# EAGLE design scheme3 (EAGLE 8.1.0)
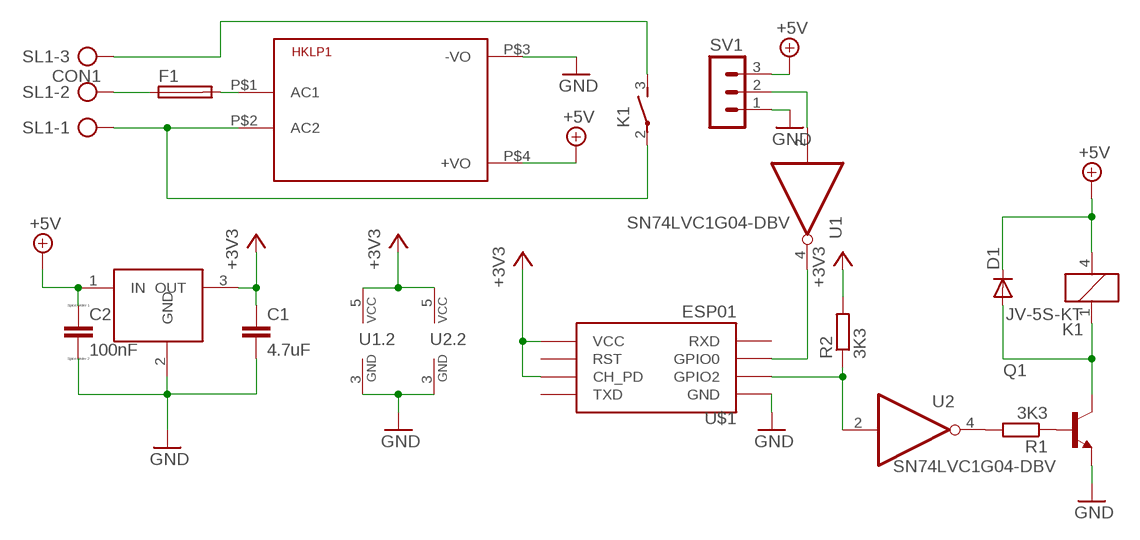
[diagram p0: schematic, sheet 1]

## Parts
C1  4.7uF  C-EUC0805  [C0805]
C2  100nF  CC0603  [C0603]
D1  D-SOD123  [SOD123]
F1  TE5  [TE5]
HKLP1  HKLPM01  [HKLPM01]
K1  JV-5S-KT  [JV-KT]
Q1  BC817-16-NPN-SOT23-BEC  [SOT23-BEC]
R1  3K3  R-EU_R0603  [R0603]
R2  3K3  R-EU_R0603  [R0603]
SL1  CON1  AK300/3  [AK300/3]
SV1  MA03-1  [MA03-1]
U1  SN74LVC1G04-DBV  [SOT23-5]
U2  SN74LVC1G04-DBV  [SOT23-5]
U$1  ESP01  [ESP01]
U$2  LF33CV  [TO220V]

## Nets
+3V3: C1.1 R2.2 U1.5(VCC) U2.5(VCC) U$1.CH_PD U$1.VCC U$2.3(OUT)
+5V: C2.1 D1.1(C) HKLP1.P$4(+VO) K1.4 SV1.3 U$2.1(IN)
GND: C1.2 C2.2 HKLP1.P$3(-VO) Q1.E SV1.1 U1.3(GND) U2.3(GND) U$1.GND U$2.2(GND)
N$1: Q1.B R1.1
N$2: R2.1 U2.2(A) U$1.GPIO2
N$4: R1.2 U2.4(Y)
N$5: D1.2(A) K1.1 Q1.C
N$6: F1.1 SL1.2
N$7: SV1.2 U1.2(A)
N$8: HKLP1.P$2(AC2) K1.2(P) SL1.1
N$9: K1.3(S) SL1.3
N$10: F1.2 HKLP1.P$1(AC1)
N$11: U1.4(Y) U$1.GPIO0
Unconnected: U$1.RST U$1.RX(RXD) U$1.TX(TXD)

## Library data of the parts
C1 = resistor:C-EU: CAPACITOR, European symbol
C2 = eagle-ltspice:C: CAPACITOR, European symbol; SPICEMODEL: NONE; SPICEPREFIX: C
D1 = semicon-smd-ipc:D-: DIODE unfilled
F1 = fuse:TE5: FUSE Wickmann; OC_FARNELL: unknown; OC_NEWARK: unknown
HKLP1 = HKLPM01:HKLPM01
K1 = relay:JV*-KT: POWER RELAY JV SERIES 1 POLE—5 A (MEDIUM LOAD CONTROL) Source: Data sheet <http://www.produktinfo.conrad.com/datenblaetter/500000-524999/502946-da-01-en-RELAIS_JV_12S_KT.pdf>
Q1 = transistor:*-NPN-: NPN Transistror BF959 corrected 2008.03.06
R1 R2 = resistor:R-EU_: RESISTOR, European symbol
SL1 = con-ptr500:AK300/3: CONNECTOR; OC_FARNELL: unknown; OC_NEWARK: unknown
SV1 = con-lstb:MA03-1: PIN HEADER; OC_FARNELL: unknown; OC_NEWARK: unknown
U1 U2 = m-pad-2.1:SN74LVC1G04: Ti's SN74LVC1G04 SINGLE INVERTER GATE Description: This single inverter gate is designed for 1.65-V to 5.5-V VCC operation. The SN74LVC1G04 performs the Boolean function Y = /A. NanoStar and NanoFree package technology is a major breakthrough in IC packaging concepts, using the die as the package. This device is fully specified for partial-power-down applications using Ioff. The Ioff circuitry disables the outputs, preventing damaging current backflow through the device when it is powered down. Features: Available in the Texas Instruments NanoStar? and NanoFree? Packages Ioff Supports Partial-Power-Down Mode Operation Supports 5-V VCC Operation · Latch-Up Performance Exceeds 100 mA Per Inputs Accept Voltages to 5.5 V JESD 78, Class II Max tpd of 3.3 ns at 3.3 V Low Power Consumption, 10-uA Max ICC ±24-mA Output Drive at 3.3 V ESD Protection Exceeds JESD 22 - 2000-V Human-Body Model (A114-A) - 200-V Machine Model (A115-A) - 1000-V Charged-Device Model (C101) Please send any comments to: messi@users.sourceforge.net
U$1 = esp8266modules:ESP01: ESP8266 Wifi module 01
U$2 = LF33CV:LF33CV

## Board
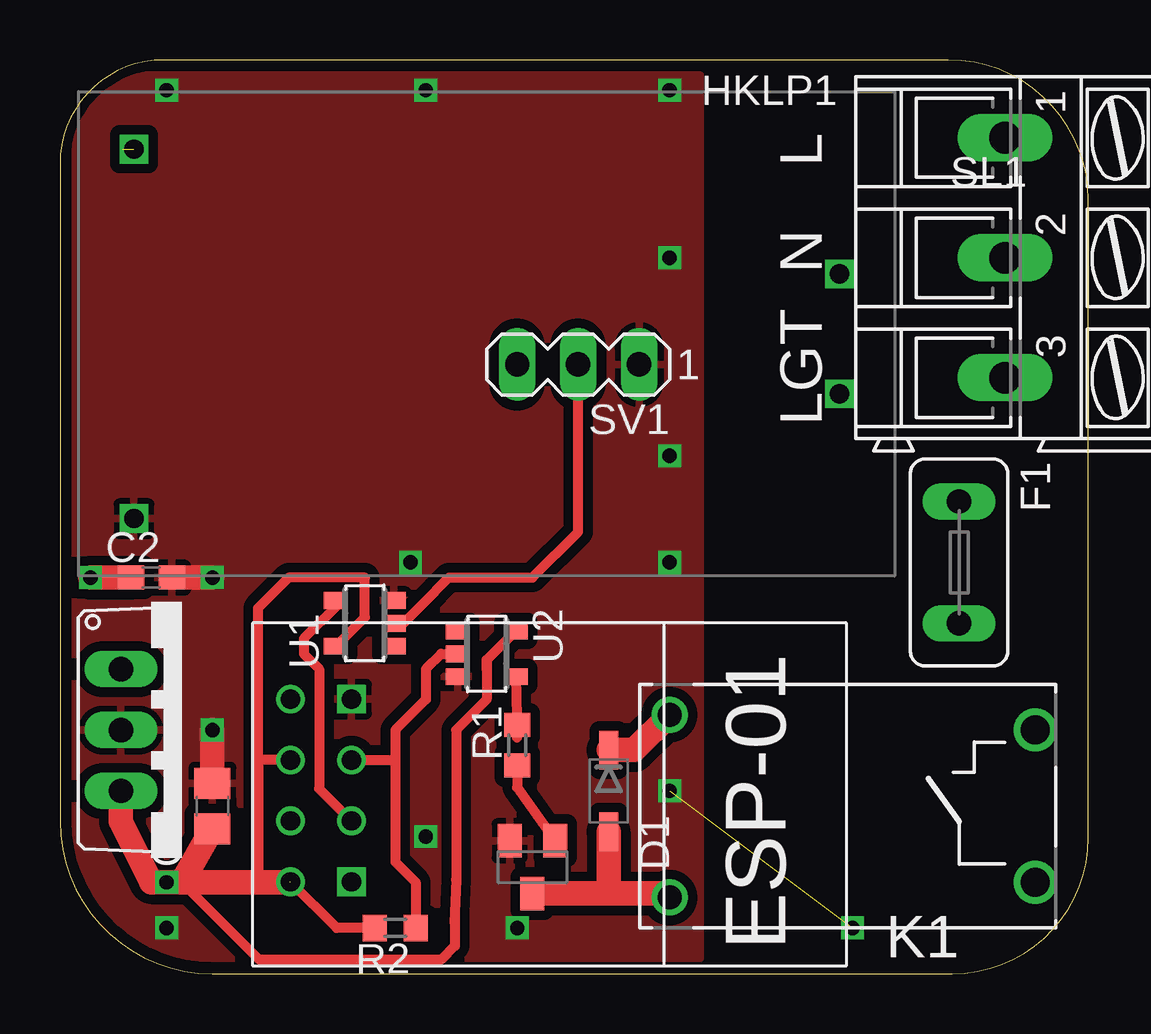
[diagram p1: board, top side]
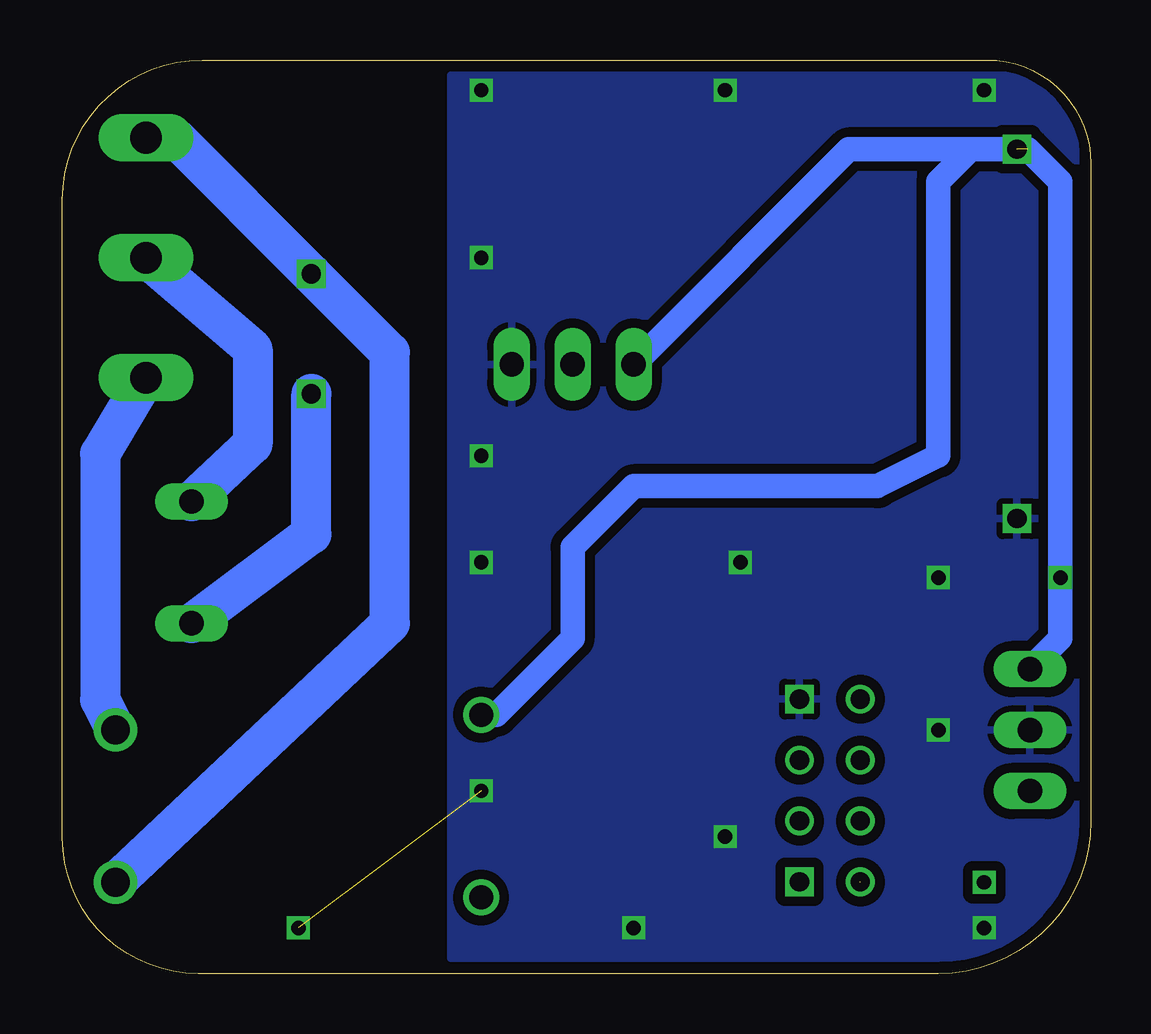
[diagram p2: board, bottom side, seen from below]

Size 42.85 x 38.09 mm. Coordinates in mm from the lower left corner, seen from the top.
Outline: 42.85,5.66 42.85,32.26 arc90 37.02,38.09 4.32,38.09 arc90 0,33.77 0,6.35 arc90 6.35,0 37.18,0 arc90 42.85,5.66
Copper layers (1*16): Top 0.0356mm / dielectric 1.5011mm / Bottom 0.0356mm
Design rules "oshpark-2layer": minimum track width 6mil, minimum drill 13mil, track to track 6mil, track to pad 6mil, pad to pad 6mil, via to via 6mil, smd to smd 6mil, copper to edge 15mil, drill to drill 6mil, minimum pad ring 7mil, minimum via ring 7mil, stop-mask expansion 2.5mil, vias tented up to drill 0mil, thermal gap 10mil

### Footprints (pad centres in the part's own frame; a part is rotated, then mirrored left to right if it is on the bottom)
C0805 = smd 1.3 x 1.5: 1 -0.95,0; 2 0.95,0
C0603 = smd 1.1 x 1: 1 -0.85,0; 2 0.85,0
SOD123 = smd 1.6 x 0.8: 1 -1.7,0; 2 1.7,0
TE5 = drill 1.016 long: 1 -2.54,0; 2 2.54,0
HKLPM01 = drill 0.8 square: P$1 -14.7,2.5; P$2 -14.7,-2.5; P$3 14.7,7.7; P$4 14.7,-7.7
JV-KT = drill 1: 1 -7.62,-3.81; 4 -7.62,3.81 | drill 1.2: 2 7.62,-3.175; 3 7.62,3.175
SOT23-BEC = smd 1 x 1.4: B -0.95,-1.1; C 0,1.1; E 0.95,-1.1
R0603 = smd 1 x 1.1: 1 -0.85,0; 2 0.85,0
AK300/3 = drill 1.321 long: 1 -5.004,0; 2 0,0; 3 5.004,0
MA03-1 = drill 1.016 long: 1 -2.54,0; 2 0,0; 3 2.54,0
SOT23-5 = smd 0.7 x 1: 1 -0.95,-1.2; 2 0,-1.2; 3 0.95,-1.2; 4 0.95,1.2; 5 -0.95,1.2
ESP01 = drill 0.8: CH_PD -1.285,-8.178; GPIO0 1.255,-5.638; GPIO2 -1.285,-5.638; RST 1.255,-8.178; TX -3.825,-8.178; VCC 3.795,-8.178 | drill 0.8 square: GND -3.825,-5.638; RX 3.795,-5.638
TO220V = drill 1.016 long: 1 -2.54,0; 2 0,0; 3 2.54,0

### Placement (x,y rotation side)
C1  6.35,6.98 90 top
C2  3.81,16.51 0 top
D1  22.86,7.62 270 top
F1  37.46,17.15 270 top
HKLP1  17.78,26.67 180 top
K1  33.02,6.98 0 top
Q1  19.68,4.45 180 top
R1  19.05,9.53 90 top
R2  13.97,1.91 180 top
SL1  39.37,29.85 270 top
SV1  21.59,25.4 180 top
U1  12.7,14.61 90 top
U2  17.78,13.34 270 top
U$1  17.78,7.62 270 top
U$2  2.54,10.16 270 top

### Tracks (layer width: path | path; a pad name or v marks a point on that pad's centre or on a via)
+3V3  (via drill 0.6)  (1 unrouted)
  Top 0.406: 5.08,3.81 8.31,0.58 15.88,0.58 16.45,1.16 16.45,2.54 | 16.45,2.54 16.51,3.93 16.51,10.16 17.78,11.43 17.78,12.7 | 16.45,2.54 16.43,2.14 | 17.78,13.09 17.78,12.7 | R2.2 11.52,1.91 U$1.VCC | 8.26,8.89 8.26,15.24 9.52,16.51 12.7,16.51 12.7,14.86 U1.5 | 8.26,8.89 8.26,3.81 | U$1.CH_PD 8.27,8.91 8.26,8.89 | 17.78,12.7 17.78,13.09 | 17.78,13.09 U2.5
  Top 1.016: C1.1 5.08,3.81 v4.45,3.81 | U$2.3 2.54,6.35 3.81,3.81 v4.45,3.81 | v4.45,3.81 8.26,3.81 9.6,3.81
+5V  (via drill 0.6)  (1 unrouted)
  Top 1.016: v1.27,16.51 C2.1 | D1.1 23.93,9.32 K1.4
  Bottom 1.016: SV1.3 10.08,34.37 HKLP1.P$4 5,34.37 6.35,33.02 6.35,21.59 8.89,20.32 19.05,20.32 21.59,17.78 21.59,13.97 24.77,10.8 K1.4 | U$2.1 1.27,13.97 v1.27,16.51 1.27,33.02 2.62,34.37
GND  (via drill 0.6)  (1 unrouted)
  Top 1.016: v6.35,10.16 C1.2 | C2.2 v6.35,16.51
  other vias: 14.6,17.15 25.4,36.83 15.24,36.83 4.45,36.83 19.05,1.91 33.02,1.91 4.45,1.91 25.4,21.59 25.4,7.62 15.24,5.72 25.4,29.85 25.4,17.15
  pour Top (isolate 0.406): 26.67,0.64 26.67,37.46 3.81,37.46 arc90 0.63,34.29 0.63,6.35 arc90 6.35,0.64
  pour Bottom (isolate 0.406): 26.67,0.64 26.67,37.46 3.81,37.46 arc90 0.63,34.29 0.63,6.35 arc90 6.35,0.64
N$1
  Top 0.406: R1.1 19.05,7.77 Q1.B
N$2
  Top 0.406: U2.2 15.88,13.34 15.24,12.7 15.24,11.43 13.97,10.16 13.97,8.89 | R2.1 14.82,3.81 13.97,4.66 13.97,8.89 | U$1.GPIO2 13.96,8.91 13.97,8.89
N$4
  Top 0.406: U2.4 19.05,9.85 R1.2
N$5
  Top 1.016: Q1.C 22.86,3.35 | D1.2 22.86,3.35 | 22.86,3.35 25.23,3.35 K1.1
N$6
  Bottom 1.676: SL1.2 34.93,26.04 34.93,22.08 F1.1
N$7
  Top 0.406: 21.59,24.13 SV1.2 21.59,18.41 19.68,16.51 16.21,16.51 15.09,15.39 | 15.24,15.54 15.09,15.39 | 15.09,15.39 14.3,14.61 U1.2
N$8
  Bottom 1.676: K1.2 29.21,14.61 29.21,25.9 HKLP1.P$2 38.16,34.85 SL1.1
N$9
  Bottom 1.676: SL1.3 41.27,21.67 41.27,11.43 K1.3
N$10
  Bottom 1.676: F1.2 32.48,18.32 HKLP1.P$1
N$11
  Top 0.406: U$1.GPIO0 10.79,7.71 10.79,12.7 10.16,13.34 10.16,13.97 11.5,15.31 U1.4

### Text on the board
tNames: L | N | LGT